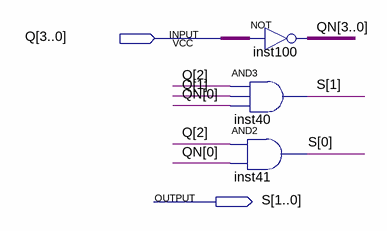
[diagram p0: schematic sheet]
// Quartus schematic S.bdf as structural Verilog: 3 symbols, 2 pins
module S (
  input  [3:0] Q,
  output [1:0] S
);

  wire [3:0] QN;

  and inst40 (S[1], Q[2], Q[1], QN[0]);
  and inst41 (S[0], Q[2], QN[0]);
  assign QN = ~Q;  // NOT inst100, 4 bits wide
endmodule
